# EAGLE board Visually impaired v6 panel - v1 (EAGLE 6.5.0)
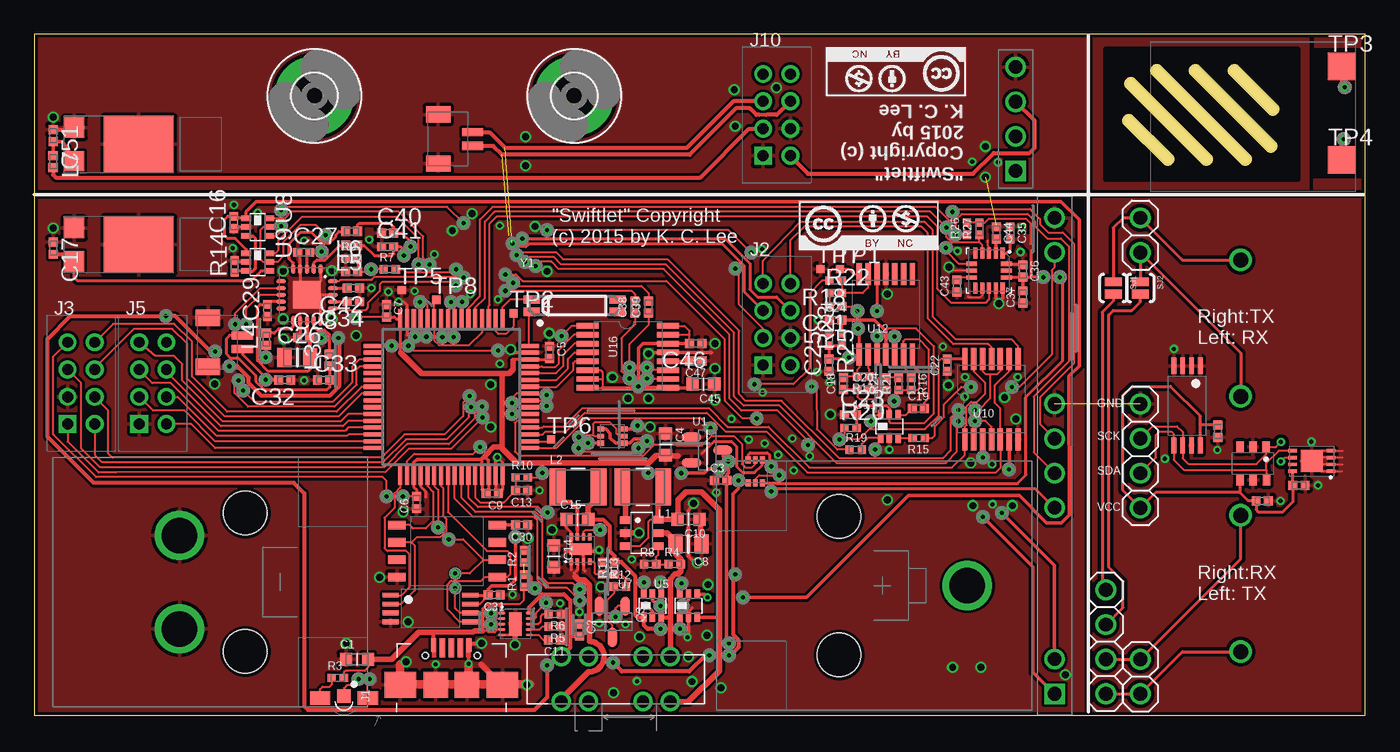
[diagram p4: board, top side]
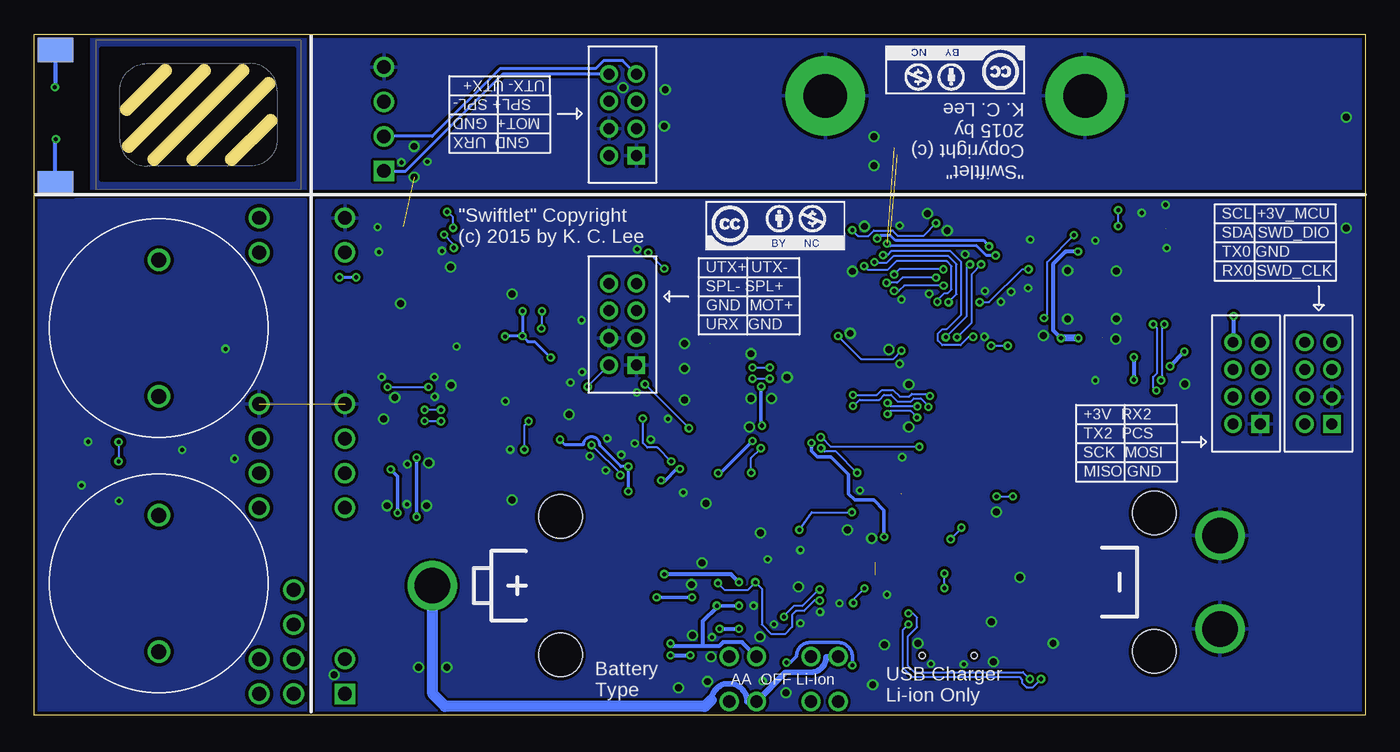
[diagram p5: board, bottom side, seen from below]

Size 97.66 x 50 mm. Coordinates in mm from the lower left corner, seen from the top.
Outline: 0,0 97.66,0 97.66,50 0,50 0,0
Copper layers (1*16): Top 0.035mm / dielectric 1.5mm / Bottom 0.035mm
Design rules "Elecrow 2-layer eagle rule": minimum track width 6mil, minimum drill 12mil, track to track 6mil, track to pad 6mil, pad to pad 6mil, via to via 6mil, smd to smd 0mil, copper to edge 10mil, drill to drill 10mil, minimum pad ring 10mil, minimum via ring 6mil, stop-mask expansion 2mil, vias tented up to drill 100mil, thermal gap 10mil
tRestrict: area 78.6,39.4 to 92.7,48.9; 17 lines
bRestrict: area 78.6,39.4 to 92.7,48.9

## Footprints (pad centres in the part's own frame; a part is rotated, then mirrored left to right if it is on the bottom)
ULTRASONIC_ASM = drill 1: GND 0,3.81; RX+ 0,14.922; RX- 0,17.462; SCK 0,-1.27; SDA 0,1.27; TX- 0,-14.922; VCC 0,-3.81 | drill 1 square: TX+ 0,-17.462
ULTRASONIC-SENSOR-ONLY = drill 1: RX+ 0,2.54; TX+ 0,7.62; TX- 0,5.08 | drill 1 square: RX- 0,0
CAPC1608X92N = smd 0.9 x 0.95: 1 -0.8,0; 2 0.8,0
CAPC1005X60N = smd 0.65 x 0.65: 1 -0.45,0; 2 0.45,0
CAP2012X70N = smd 1.05 x 1.4: 1 -0.95,0; 2 0.95,0
LED_1204 = smd 1 x 1.5: 1 -0.25,-1.75; 3 -0.25,1.75 | smd 1 x 1: 2 -0.4,0
3,2-PAD = drill 3.2 pad 5.842: B3,2 0,0
USB-AB-MICRO-SMD_V03_SF = smd 1.4 x 0.4: D+ 2.7,0; D- 2.7,0.65; ID1 2.7,-0.65 | smd 0.975 x 0.4: GND 2.913,-1.3; VBUS1 2.913,1.3 | smd 1.9 x 2.3: S1 0,3.75; S4 0,-3.75 | smd 1.9 x 1.8: S2 0,1.15; S3 0,-1.15 | hole 0.45: 2.15,1.9; 2.15,-1.9
DF11-8DP-2DSA = drill 0.8 square: 1 3,-1 | drill 0.8: 2 3,1; 3 1,-1; 4 1,1; 5 -1,-1; 6 -1,1; 7 -3,-1; 8 -3,1
BM02B-SRSS-TB = smd 0.6 x 1.55: 1 -0.5,1.825; 2 0.5,1.825 | smd 1.2 x 1.8: PAD@1 -1.8,-0.7; PAD@2 1.8,-0.7
1X04R = drill 1.016: 1 -3.81,0; 2 -1.27,0; 3 1.27,0; 4 3.81,0
1X02 = drill 1.016: 1 -1.27,0; 2 1.27,0
INDC3225X135N = smd 1.15 x 2.7: 1 -1.5,0; 2 1.5,0
INDC1005X60N = smd 0.65 x 0.7: 1 -0.45,0; 2 0.45,0
2RB18Z1BS = smd 1.5 x 1.5: 1 3.28,1.233; 2 3.28,-1.233 | smd 5.15 x 4.12: PAD -1.46,0
CB-AA-PC-POS = drill 2.6: 1 -9.398,0 | hole 3.2: 0,-5.08; 0,5.08
CB-AA-PC-NEG = drill 2.6: 1 4.826,3.429; 2 4.826,-3.429 | hole 3.2: 0,5.08; 0,-5.08
SOT563 = smd 0.375 x 0.5: P$1 -0.517,-0.85; P$3 0.517,-0.85; P$4 0.517,0.85; P$6 -0.517,0.85 | smd 0.34 x 0.5: P$2 0,-0.85; P$5 0,0.85
SOT95P280X135-3N = smd 1.4 x 0.65: 1 -1.15,0.95; 2 -1.15,-0.95; 3 1.15,0
RESC1005X40AN = smd 0.6 x 0.6: 1 -0.45,0; 2 0.45,0
SW-JS203011AQN = drill 0.9: 1 -4,-1.65; 2 -2,-1.65; 3 2,-1.65; 4 4,-1.65; 5 -4,1.65; 6 -2,1.65; 7 2,1.65; 8 4,1.65
SJ_2S-NO = smd 0.635 x 1.27: 1 -0.45,0; 2 0.45,0
2403-269-00001 = smd 2.6 x 1.8 bottom: + 6.7,4.89; - 6.7,-4.89
TCT40-16 = drill 1.1: P$1 -5,0; P$2 5,0
TP06SQ = smd 0.6 x 0.6: TP 0,0
TP20SQ = smd 2 x 2: TP 0,0
LQFP64 = smd 1.5 x 0.3: 1 -5.7,3.75; 2 -5.7,3.25; 3 -5.7,2.75; 4 -5.7,2.25; 5 -5.7,1.75; 6 -5.7,1.25; 7 -5.7,0.75; 8 -5.7,0.25; 9 -5.7,-0.25; 10 -5.7,-0.75; 11 -5.7,-1.25; 12 -5.7,-1.75; 13 -5.7,-2.25; 14 -5.7,-2.75; 15 -5.7,-3.25; 16 -5.7,-3.75; 33 5.7,-3.75; 34 5.7,-3.25; 35 5.7,-2.75; 36 5.7,-2.25; 37 5.7,-1.75; 38 5.7,-1.25; 39 5.7,-0.75; 40 5.7,-0.25; 41 5.7,0.25; 42 5.7,0.75; 43 5.7,1.25; 44 5.7,1.75; 45 5.7,2.25; 46 5.7,2.75; 47 5.7,3.25; 48 5.7,3.75 | smd 0.3 x 1.5: 17 -3.75,-5.7; 18 -3.25,-5.7; 19 -2.75,-5.7; 20 -2.25,-5.7; 21 -1.75,-5.7; 22 -1.25,-5.7; 23 -0.75,-5.7; 24 -0.25,-5.7; 25 0.25,-5.7; 26 0.75,-5.7; 27 1.25,-5.7; 28 1.75,-5.7; 29 2.25,-5.7; 30 2.75,-5.7; 31 3.25,-5.7; 32 3.75,-5.7; 49 3.75,5.7; 50 3.25,5.7; 51 2.75,5.7; 52 2.25,5.7; 53 1.75,5.7; 54 1.25,5.7; 55 0.75,5.7; 56 0.25,5.7; 57 -0.25,5.7; 58 -0.75,5.7; 59 -1.25,5.7; 60 -1.75,5.7; 61 -2.25,5.7; 62 -2.75,5.7; 63 -3.25,5.7; 64 -3.75,5.7
TDFN-10 = smd 0.5 x 0.2: 1 -1,0.8; 2 -1,0.4; 3 -1,0; 4 -1,-0.4; 5 -1,-0.8; 6 1,-0.8; 7 1,-0.4; 8 1,0; 9 1,0.4; 10 1,0.8 | smd 0.9 x 1.7: EP 0,0
SOT26 = smd 0.55 x 0.8: 1 -0.95,-1.2; 2 0,-1.2; 3 0.95,-1.2; 4 0.95,1.2; 5 0,1.2; 6 -1,1.2
DCK_R-PDSO-G6 = smd 0.4 x 0.7: 1 -0.65,-0.85; 2 0,-0.85; 3 0.65,-0.85; 4 0.65,0.85; 5 0,0.85; 6 -0.65,0.85
STDFN22-8 = smd 0.25 x 0.5: 1 -0.675,-0.9; 2 -0.225,-0.9; 3 0.225,-0.9; 4 0.675,-0.9; 5 0.675,0.9; 6 0.225,0.9; 7 -0.225,0.9; 8 -0.675,0.9 | smd 1.6 x 0.85: PAD 0,0
TSSOP14 = smd 0.4 x 1.6: 1 -1.95,-2.851; 2 -1.3,-2.851; 3 -0.65,-2.851; 4 0,-2.851; 5 0.65,-2.851; 6 1.3,-2.851; 7 1.95,-2.851; 8 1.95,3.049; 9 1.3,3.049; 10 0.65,3.049; 11 0,3.049; 12 -0.65,3.049; 13 -1.3,3.049; 14 -1.95,3.049
S0C008 = smd 0.635 x 1.27: 1 -1.905,-3.683; 2 -0.635,-3.683; 3 0.635,-3.683; 4 1.905,-3.683; 5 1.905,3.683; 6 0.635,3.683; 7 -0.635,3.683; 8 -1.905,3.683
TSSOP8 = smd 0.35 x 1.2: 1 -0.975,-2.925; 2 -0.325,-2.925; 3 0.325,-2.925; 4 0.975,-2.925; 5 0.975,2.925; 6 0.325,2.925; 7 -0.325,2.925; 8 -0.975,2.925
QFN4040-20 = smd 0.7 x 0.28: 1 -1.9,1; 2 -1.9,0.5; 3 -1.9,0; 4 -1.9,-0.5; 5 -1.9,-1; 11 1.9,-1; 12 1.9,-0.5; 13 1.9,0; 14 1.9,0.5; 15 1.9,1 | smd 0.28 x 0.7: 6 -1,-1.9; 7 -0.5,-1.9; 8 0,-1.9; 9 0.5,-1.9; 10 1,-1.9; 16 1,1.9; 17 0.5,1.9; 18 0,1.9; 19 -0.5,1.9; 20 -1,1.9 | smd 2 x 2: PAD 0,0
TSSOP16 = smd 0.4 x 1.6: 1 -2.275,-2.85; 2 -1.625,-2.85; 3 -0.975,-2.85; 4 -0.325,-2.85; 5 0.325,-2.85; 6 0.975,-2.85; 7 1.625,-2.85; 8 2.275,-2.85; 9 2.275,3.05; 10 1.625,3.05; 11 0.975,3.05; 12 0.325,3.05; 13 -0.325,3.05; 14 -0.975,3.05; 15 -1.625,3.05; 16 -2.275,3.05
QFN16_0P5_3X3 = smd 0.8 x 0.3: 1 -1.275,1; 2 -1.275,0.5; 3 -1.275,0; 4 -1.275,-0.5; 5 -1.275,-1; 9 1.275,-1; 10 1.275,-0.5; 11 1.275,0; 12 1.275,0.5; 13 1.275,1 | smd 0.3 x 0.8: 6 -0.5,-1.275; 7 0,-1.275; 8 0.5,-1.275; 14 0.5,1.275; 15 0,1.275; 16 -0.5,1.275
SOT1069-2 = smd 0.25 x 0.625: 1 -0.75,-1.413; 2 -0.25,-1.413; 3 0.25,-1.413; 4 0.75,-1.413; 5 0.75,1.413; 6 0.25,1.413; 7 -0.25,1.413; 8 -0.75,1.413 | smd 1.6 x 1.6: PAD 0,0
9HT7 = smd 1.2 x 0.6: 1 -3.15,-0.45; 2 3.15,-0.45; 3 3.15,0.45; 4 -3.15,0.45

## Placement (x,y rotation side)
A1  ULTRASONIC_TEMP  [ULTRASONIC_ASM]  74.85,19.05 0 top
A2  ULTRASONIC-ASM-SENSOR-ONLY  [ULTRASONIC-SENSOR-ONLY]  72,39.95 0 top
C1  4.7uF  [CAPC1608X92N]  23.7,4.11 0 top
C2  1uF  [CAPC1005X60N]  40.01,6.27 270 top
C3  0.1uF  [CAPC1005X60N]  50.37,17.25 0 top
C4  1uF  [CAPC1608X92N]  46.33,19.89 270 top
C5  0.1uF  [CAPC1005X60N]  37.82,26.64 270 top
C6  0.1uF  [CAPC1005X60N]  28.07,15.62 90 top
C7  0.1uF  [CAPC1005X60N]  25.86,29.69 270 top
C8  10uF  [CAP2012X70N]  48.01,12.6 180 top
C9  0.1uF  [CAPC1005X60N]  33.6,16.28 180 top
C10  4.7uF  [CAPC1608X92N]  48.01,14.4 180 top
C11  0.1uF  [CAPC1005X60N]  38.18,5.56 180 top
C12  1nF  [CAPC1005X60N]  23.29,32.56 0 top
C13  1nF  [CAPC1005X60N]  35.76,16.51 180 top
C14  4.7uF  [CAPC1608X92N]  38.13,11.68 270 top
C15  4.7uF  [CAPC1608X92N]  39.85,14.38 0 top
C16  0.1uF  [CAPC1005X60N]  14.66,36.17 90 top
C17  10nF  [CAPC1005X60N]  1.4,34.29 270 top
C18  1nF  [CAPC1005X60N]  59.36,24.36 90 top
C19  1nF  [CAPC1005X60N]  64.87,22.53 0 top
C20  1nF  [CAPC1005X60N]  60.83,23.9 0 top
C21  10nF  [CAPC1005X60N]  58.8,30.02 180 top
C22  1uF  [CAPC1005X60N]  66.98,25.7 90 top
C23  1uF  [CAPC1005X60N]  59.89,22.07 0 top
C24  0.1uF  [CAPC1005X60N]  58.8,29.01 0 top
C25  10nF  [CAPC1005X60N]  58.32,25.7 90 top
C26  10uF  [CAP2012X70N]  19.3,26.26 0 top
C27  1uF  [CAPC1005X60N]  19.79,33.99 0 top
C28  1uF  [CAPC1005X60N]  19.76,27.74 0 top
C29  1uF  [CAPC1005X60N]  17.12,29.72 90 top
C30  1uF  [CAPC1005X60N]  35.76,13.97 180 top
C31  0.1uF  [CAPC1005X60N]  33.76,8.84 180 top
C32  220pF  [CAPC1005X60N]  18.39,24.61 180 top
C33  220pF  [CAPC1005X60N]  21.23,24.61 0 top
C34  0.1uF  [CAPC1005X60N]  23.42,30.35 180 top
C35  0.1uF  [CAPC1005X60N]  71.6,35.41 270 top
C36  0.1uF  [CAPC1005X60N]  72.54,32.61 270 top
C37  1uF  [CAPC1005X60N]  72.54,30.71 90 top
C38  0.1uF  [CAPC1005X60N]  44.07,29.97 90 top
C39  0.1uF  [CAPC1005X60N]  45.09,29.97 90 top
C40  220pF  [CAPC1005X60N]  25.93,35.41 0 top
C41  220pF  [CAPC1005X60N]  25.93,34.39 0 top
C42  0.1uF  [CAPC1005X60N]  23.42,31.37 180 top
C43  0.1uF  [CAPC1005X60N]  67.69,31.52 90 top
C44  0.1uF  [CAPC1005X60N]  70.59,35.41 270 top
C45  4.7uF  [CAPC1608X92N]  49.1,24.31 180 top
C46  0.1uF  [CAPC1005X60N]  48.54,27.3 180 top
C47  1uF  [CAPC1005X60N]  48.54,26.01 180 top
C48  0.1uF  [CAPC1005X60N]  92.79,16.89 180 top
C49  0.1uF  [CAPC1005X60N]  86.84,20.85 90 top
C50  0.1uF  [CAPC1005X60N]  90.09,15.75 180 top
C51  10nF  [CAPC1005X60N]  1.4,42.55 270 top
D1  1204-SIDE-DUAL-AG  [LED_1204]  22.73,1.02 270 top
GRILL1  2403-260-00001-GRILL  [24030269-00001-GRILL]  85.6,44.07 0 bottom
H1  MOUNT-PAD-ROUND3.2  [3,2-PAD]  20.57,45.47 0 top
H2  MOUNT-PAD-ROUND3.2  [3,2-PAD]  39.62,45.47 0 top
J1  [USB-AB-MICRO-SMD_V03_SF]  30.61,2.26 90 top
J2  DF11-8DP-2DSA  [DF11-8DP-2DSA]  54.48,28.7 270 top
J3  DF11-8DP-2DSA  [DF11-8DP-2DSA]  3.45,24.38 270 top
J4  BM02B-SRSS-TB  [BM02B-SRSS-TB]  13.46,27.38 270 top
J5  DF11-8DP-2DSA  [DF11-8DP-2DSA]  8.71,24.38 270 top
J6  [1X04R]  78.61,5.4 270 top
J7  [1X02]  81.15,35.24 90 top
J8  [1X02]  81.15,2.86 90 top
J9  [1X04R]  81.15,19.05 90 top
J10  DF11-8DP-2DSA  [DF11-8DP-2DSA]  54.48,44.07 270 top
J11  BM02B-SRSS-TB  [BM02B-SRSS-TB]  30.35,42.29 270 top
L1  CBC3225T4R7MR  [INDC3225X135N]  44.65,16.76 180 top
L2  CBC3225T4R7MR  [INDC3225X135N]  39.9,16.76 0 top
L3  F600R  [INDC1005X60N]  21.67,26.09 90 top
L4  F600R  [INDC1005X60N]  17.04,27.61 90 top
L5  F600R  [INDC1005X60N]  23.29,34.49 180 top
L6  F600R  [INDC1005X60N]  23.29,35.51 180 top
L7  F600R  [INDC1005X60N]  1.4,40.64 270 top
M1  2RB18Z1BS  [2RB18Z1BS]  6.22,34.54 180 top
M2  2RB18Z1BS  [2RB18Z1BS]  6.22,41.91 180 top
P1  CB-AA-PC-POS  [CB-AA-PC-POS]  59.05,9.53 180 top
P2  CB-AA-PC-NEG  [CB-AA-PC-NEG]  15.49,9.78 180 top
Q1  DMG1023UV  [SOT563]  52.91,17.91 180 top
Q2  DMG1023UV  [SOT563]  42.42,20.5 270 top
Q3  2N7002  [SOT95P280X135-3N]  42.42,6.88 270 top
R1  10K  [RESC1005X40AN]  35.94,9.88 90 top
R2  10K  [RESC1005X40AN]  35.94,11.68 90 top
R3  1K  [RESC1005X40AN]  22.28,2.77 0 top
R4  976K  [RESC1005X40AN]  46.99,11.1 0 top
R5  3.16K  [RESC1005X40AN]  38.2,6.53 180 top
R6  6.65K  [RESC1005X40AN]  38.2,7.44 180 top
R7  1M  [RESC1005X40AN]  26.09,32.74 0 top
R8  562K  [RESC1005X40AN]  45.19,11.1 0 top
R9  562K  [RESC1005X40AN]  23.29,33.53 0 top
R10  220K  [RESC1005X40AN]  35.76,17.48 0 top
R11  1M  [RESC1005X40AN]  42.6,10.82 90 top
R12  402K  [RESC1005X40AN]  42.98,9.45 0 top
R13  665K  [RESC1005X40AN]  41.68,10.82 270 top
R14  0R  [RESC1005X40AN]  14.71,32.94 90 top
R15  10K  [RESC1005X40AN]  64.9,20.37 180 top
R16  220K  [RESC1005X40AN]  64.34,24.33 270 top
R17  22K  [RESC1005X40AN]  60.83,24.87 180 top
R18  22K  [RESC1005X40AN]  58.8,31.9 180 top
R19  10K  [RESC1005X40AN]  60.27,19.51 0 top
R20  22R  [RESC1005X40AN]  59.89,21.11 0 top
R21  1K5  [RESC1005X40AN]  63.42,24.33 90 top
R22  3.16K  [RESC1005X40AN]  58.8,30.99 0 top
R23  10K  [RESC1005X40AN]  59.26,27.58 90 top
R24  1K  [RESC1005X40AN]  62.51,24.33 90 top
R25  10K  [RESC1005X40AN]  58.32,27.58 270 top
R26  10K  [RESC1005X40AN]  68.43,35.71 90 top
R27  10K  [RESC1005X40AN]  69.34,35.71 90 top
S1  CL-SB-23C-11  [SW-JS203011AQN]  42.67,2.67 0 top
SJ1  [SJ_2S-NO]  79.17,31.37 270 top
SJ2  [SJ_2S-NO]  81.15,31.37 270 top
SPK1  2403-260-00001TOP  [2403-269-00001]  89.41,43.94 0 top
T1  TCT40-16T  [TCT40-16]  88.52,28.42 90 bottom
T2  TCT40-16T  [TCT40-16]  88.52,9.68 90 bottom
TP1  TPTP06SQ  [TP06SQ]  59.11,32.77 0 top
TP2  TPTP06SQ  [TP06SQ]  35.18,29.51 0 top
TP3  TPSTP20SQ  [TP20SQ]  95.91,47.62 0 top
TP4  TPSTP20SQ  [TP20SQ]  95.91,40.77 0 top
TP5  TPTP06SQ  [TP06SQ]  26.97,31.22 0 top
TP6  TPTP06SQ  [TP06SQ]  37.92,20.24 0 top
TP7  TPTP06SQ  [TP06SQ]  57.68,32.77 0 top
TP8  TPTP06SQ  [TP06SQ]  29.51,30.51 0 top
U1  MCP1700T-3002E/TT  [SOT95P280X135-3N]  49.38,19.48 0 top
U2  MKL16Z256VLH4  [LQFP64]  30.61,23.37 90 top
U3  AAT3693  [TDFN-10]  35.31,6.71 0 top
U4  MCP1640T-I/CHY  [SOT26]  44.58,13.39 270 top
U5  NLAS4157  [DCK_R-PDSO-G6]  48.01,8.05 0 top
U6  AAT2120  [STDFN22-8]  40.08,12.19 0 top
U7  NLAS4157  [DCK_R-PDSO-G6]  45.36,8.05 0 top
U8  NLAS4157  [DCK_R-PDSO-G6]  16.41,35.84 270 top
U9  NLAS4157  [DCK_R-PDSO-G6]  16.41,33.27 270 top
U10  74LVC08A  [TSSOP14]  70.23,23.11 0 top
U11  TC7SB3157CFU  [DCK_R-PDSO-G6]  62.74,21.21 0 top
U12  LMV324IPWR  [TSSOP14]  62.48,29.34 0 top
U13  S25FL127SABMFI101  [S0C008]  30.3,12.06 270 top
U14  23LC512-I/ST  [TSSOP8]  29.08,7.85 270 top
U15  PAM8404KG  [QFN4040-20]  20.02,30.86 270 top
U16  AK4386ET  [TSSOP16]  43.46,26.31 270 top
U17  FXOS8700CQR1  [QFN16_0P5_3X3]  70.05,32.64 270 top
U18  SE97BTP  [SOT1069-2]  93.73,18.67 90 top
U19  AT24C02  [TSSOP8]  84.58,22.73 180 top
U20  TMP101  [SOT26]  89.41,18.49 180 top
U$1  CC100%  [CC-100]  56.13,34.16 0 top
U$2  CC100%  [CC-100]  48.39,34.16 0 bottom
U$3  CC100%  [CC-100]  48.39,34.16 0 bottom
U$4  CC100%  [CC-100]  68.33,49.02 180 top
U$6  CC100%  [CC-100]  24.99,49.15 180 bottom
Y1  9HT7-32.768KDZF-T  [9HT7]  39.65,30.07 0 top

## Tracks (layer width: path | path; a pad name or v marks a point on that pad's centre or on a via)
1V5/3V  (via drill 0.3)
  Top 0.305: C15.2 41.73,14.38 42.22,13.89 42.22,12.09 42.6,11.71 R11.2 43.06,11.27 44.09,10.24 44.09,7.39 44.27,7.21 44.7,7.21 U7.1 44.71,6.64 45.01,6.35 v45.95,6.35 | U5.1 47.36,6.49 v47.37,6.35
  Top 0.406: L2.2 41.4,16 40.65,15.25 C15.2
  Bottom 0.305: v47.37,6.35 v45.95,6.35
3.3V/!1.5V  (via drill 0.3)
  Top 0.152: v40.03,9.25 39.55,9.68 37.72,9.68 37.29,10.11 37.29,14.45 36.8,14.94 32.38,14.94 31.36,15.96 U2.10 | Q3.1 43.35,8.05 42.82,8.05 42.65,7.87 v42.65,7.24
  Bottom 0.152: v40.03,9.25 40.08,9.25 41.3,8.03 41.94,8.03 42.65,7.32 v42.65,7.24
3V3_BOOST
  Top 0.305: U7.3 46.66,7.2 46.67,7.19
  Top 0.406: S1.8 46.67,7.19 46.67,10.03 47.03,10.39 47.24,10.39 47.45,10.59 R4.2 | U4.5 46.45,13.39 47.02,12.83 47.11,12.74 C8.2 47.11,12.51 47.09,11.81 47.45,11.46 R4.2 | R4.2
3V_CORE  (via drill 0.3)
  Top 0.152: 73.08,34.59 73.08,36.12 72.75,36.45 70.03,36.45 69.74,36.16 R27.2 R26.2
  Top 0.203: Q1.P$6 54.44,17.06 54.48,17.02 72.14,17.02 72.77,17.65 72.77,23.37 75.46,26.06 75.46,31.95 v75.26,32.16 | C36.2 72.52,32.14 U17.14 | C36.2 | U17.1 71.35,33.91 71.6,34.16 C35.2 | C36.2 73.06,32.16 73.15,32.16 | 73.15,32.16 73.15,34.11 | v74.04,32.16 73.15,32.16
  Top 0.254: C36.2 C37.2
  Bottom 0.203: v75.26,32.16 v74.04,32.16
  pour Top (isolate 0.203): 71.45,35.26 73.18,35.26 73.18,34.11 73.1,34.11 72.34,34.87 71.58,34.87 71.45,35
3V_MCU  (via drill 0.3)
  Top 0.152: 32.85,18.9 32.86,18.89 | C6.2 v27.06,16.07 v27.05,16.08 | v23.57,29.16 23.63,29.24 C7.2 | v21.39,35.26 20.68,35.97 19.53,35.97 18.29,34.72 18.29,33.71 17.86,33.27 U9.5 16.79,33.27 16.61,33.45 16.61,35.64 16.82,35.84 U8.5 | v25.86,16.08 25.86,17.22 25.58,17.5 4.55,17.5 1.42,20.62 1.42,26.35 J3.7
  Top 0.203: C5.2 37.62,26.12 U2.30 35.23,26.11 35.13,26.04 | 49,19.23 49.89,20.12 51.16,20.12 51.54,19.74 51.54,18.26 51.97,17.83 52.86,17.83 53.43,18.4 Q1.P$1 | 33.06,18.99 33.36,18.71 U2.14 33.36,16.23 C9.2 32.86,16.58 U2.13 32.86,18.89 32.89,18.92 | U2.3 27.86,16.75 28.07,16.54 C6.2 | C7.2 26.43,29.24 26.59,29.08 26.84,29.08 U2.48 26.86,26.66 26.9,26.62
  Top 0.254: U2.3 27.86,18.56 28.09,18.8 32.77,18.8 32.86,18.89
  Top 0.305: 48.17,18.47 U1.2
  Top 0.406: 34.34,19.61 35.41,18.54 45.06,18.54 45.61,19.09 C4.2 46.37,19.05 47.24,19.05 | 48.21,18.52 U1.2 | 26.9,26.62 28.42,25.09 34.34,25.09 | 34.34,25.09 34.85,25.09 35.13,25.38 35.13,26.04 | 34.34,25.09 34.34,19.61 | 33.06,18.99 33.07,19.05 33.71,19.68 34.27,19.68 34.34,19.61
  Bottom 0.152: v27.05,16.08 v25.86,16.08 | v23.57,29.16 23.34,29.39 23.34,33.27 v21.39,35.26
  pour Top (isolate 0.203): 45.72,19.53 49.4,19.51 49.4,18.26 45.72,18.29
!MEMS_EN
  Top 0.152: Q1.P$2 52.91,18.44 52.68,18.21 52.15,18.21 51.92,18.44 51.92,19.94 51.36,20.5 49.68,20.5 49,19.81 47.14,19.81 47.07,19.89 45.52,19.89 44.65,19.02 35.61,19.02 35.28,19.36 35.28,21.46 35.44,21.62 U2.21
!PERIP_EN  (via drill 0.3)
  Top 0.152: Q2.P$5 42.9,20.5 42.72,20.68 42.72,21.03 42.27,21.49 41.1,21.49 41,21.39 41,20.6 | 41,20.6 41.1,20.5 Q2.P$2 | U2.2 27.36,18.67 27.89,19.2 32.21,19.2 v32.72,19.71 | v39.95,20.42 40.13,20.6 41,20.6
  Bottom 0.152: v32.72,19.71 39.19,19.71 39.9,20.42 v39.95,20.42
!RESET
  Top 0.152: U2.34 33.86,28.2 34.04,28.02 34.65,28.02 35.18,28.55 TP2.TP
!SONAR_EN  (via drill 0.3)
  Top 0.152: Q1.P$5 52.91,17.35 53.19,17.63 v54.66,17.63 | v56.77,19.84 56.77,20.14 54.53,22.38 51.89,22.38 51,23.27 51,27.94 46.18,32.77 38.48,32.77 37.95,33.3 37.11,33.3 v36.78,32.97 | U2.39 31.36,30.32 v31.39,30.35
  Bottom 0.152: v54.66,17.63 54.66,17.75 56.62,19.68 v56.77,19.84 | v36.78,32.97 36.5,32.69 35.05,32.69 34.42,33.33 30.71,33.33 30.35,32.97 30.35,31.27 30.66,30.96 30.91,30.96 31.39,30.48 v31.39,30.35
+1.5V  (via drill 0.3)
  Top 0.203: U9.1 15.56,34.2 14.76,35 14.2,35 13.97,35.23 13.97,36.4 14.19,36.62 C16.2 14.79,36.49 U8.1 15.56,36.97 15.58,37
  Top 0.254: U5.4 49.16,8.9 v49.4,8.66 | v51.99,8.66 56.64,8.66 64.14,16.13 72.26,16.13 74.27,14.12 75.36,14.12 75.95,14.71 75.92,24.89 76.68,25.65 76.68,36.37 75.34,37.72 16.31,37.72 15.58,37
  Bottom 0.254: v49.4,8.66 v51.99,8.66
+3.0V  (via drill 0.3)
  Top 0.203: U15.3 20.02,33.83 C27.2 | U15.9 17.27,30.36 17.27,30.3 C29.2 16.58,30.17 16.38,29.97 16.38,26.04 17.17,25.25 20.09,25.25 20.25,25.41 C26.2 | U15.13 20.02,27.93 C28.2
  Top 0.254: v51.44,10.36 51.26,10.52 51.26,16.26 51.66,16.66 v51.66,17.25 51.85,17.06 Q1.P$4 | Q2.P$1 41.95,21.02 42.27,20.7 42.27,20.37 42.66,19.98 Q2.P$4 43.7,19.98 44.02,20.3 44.81,20.3 v44.96,20.14 | v47.47,17.78 49.17,17.78 49.48,18.09 v50.29,18.09
  Top 0.305: U7.4 46.01,9.72 v45.95,9.78 | v51.44,10.36 51.28,10.19 51.28,5.94 51.66,5.56 51.66,5 51.08,4.42 v50.98,4.42 | v49.53,4.42 49.25,4.42 48.06,3.23 43.13,3.23 v42.47,3.89 | v37.64,3.68 37.64,1.35 36.7,0.41 20.09,0.41 19.81,0.69 19.81,16.31 19.05,17.07 4.37,17.07 0.99,20.45 0.99,27.64 2.67,29.31 v9.68,29.31 10.34,29.31 12.95,26.7 v13.28,26.7 | C28.2 | v21.06,27.69 20.26,27.69 C28.2 | C26.2 20.25,27.69 C28.2 | v22.33,27.69 22.38,27.64 22.38,24.16 21.67,23.44 16.69,23.44 15.75,24.38 15.75,24.79 14.91,25.63 v14.33,25.63 | v21.08,34.04 21.03,33.98 C27.2
  Bottom 0.254: v42.47,3.89 42.19,3.89 41.73,4.34 arc90 40.72,5.36 38.68,5.36 arc90 37.64,4.32 v37.64,3.68 | v44.96,20.14 47.32,17.78 v47.47,17.78 | v50.29,18.09 50.52,18.09 51.38,17.22 51.64,17.22 v51.66,17.25
  Bottom 0.305: v45.95,9.78 46.53,10.36 v51.44,10.36 | v50.98,4.42 v49.53,4.42 | v9.68,29.31 9.68,27.42 J5.8 | v14.33,25.63 v13.28,26.7 | v21.08,34.04 22,34.04 22.91,33.12 22.91,28.27 v22.33,27.69
  Bottom 0.508: v21.06,27.69 v22.33,27.69
+3V_AUDIO  (via drill 0.3)  (1 unrouted)
  Top 0.152: U16.16 47.71,28.59 48.09,28.21 48.09,27.94 | U16.7 41.7,24.69 41.71,24.66 | U16.8 41.71,24.04 41.71,24.66 | U16.6 41.54,25.34 41.71,25.17 41.71,24.66 | 45.24,27.29 45.59,27.29 | U16.15 48.09,27.94 | 44.31,24.04 v44.32,24.13 | C46.2 48.09,27.94
  Top 0.254: C46.2 U16.14 45.59,27.29 44.66,27.29 44.32,26.95 v44.32,24.13 | U16.9 48.06,24.04 C45.2 | v44.27,21.26 44.03,21.02 Q2.P$6
  Top 0.305: 41.71,24.04 44.31,24.04 | U16.9 44.34,24.04 v44.32,24.13
  Bottom 0.254: v44.32,24.13 44.32,21.26 v44.27,21.26
+3V_SONAR  (via drill 0.3)
  Top 0.152: C22.2 66.52,26.16 66.37,26.01 66.37,22.02 65.35,21.01 61.27,21.01 60.5,20.24 v59.08,20.24 59.44,20.61 R20.1
  Top 0.203: Q1.P$3 52.39,19.14 52.53,19.28 53.77,19.28 53.95,19.1 53.95,18.39 v54.08,18.26 | v54.08,16.43 54.25,16.61 73.46,16.61 A1.VCC | U10.14 66.99,26.16 C22.2
  Bottom 0.203: v59.08,20.24 58.7,19.86 57.38,19.86 arc90 56.74,20.45 arc90 56.16,19.81 54.61,18.26 v54.08,18.26 54.05,18.24 54.05,16.51 v54.08,16.43
+3V_SONAR_FILTERED
  Top 0.152: U11.5 62.74,21.59 62.87,21.44 65.28,21.44 66.02,22.17 66.02,27.08 64.69,28.4 62.68,28.4 62.48,28.19
  Top 0.203: R20.2 C23.2 60.34,22.57 60.5,22.73 62.53,22.73 62.74,22.53 U11.5 | R23.2 C24.2
  Top 0.254: U12.4 62.48,28.19 61.64,29.03 59.12,29.03 C24.2
+3V_SPI  (via drill 0.3)
  Top 0.152: U14.7 32.71,8.17 33.31,8.77 C31.2
  Top 0.203: U14.8 33.25,8.82 C31.2
  Top 0.254: U13.8 C30.2 v35.31,13.11 35.31,9.96 34.85,9.5 33.55,9.5 33.31,9.25 C31.2 | v40.64,19.99 v40.63,19.98 Q2.P$3
  Top 0.305: 35.32,13.94 C30.2
  Bottom 0.254: v35.31,13.11 35.31,15.04 36.07,15.8 37.47,15.8 37.92,16.26 37.92,17.7 39.19,18.97 40.21,18.97 40.64,19.41 v40.64,19.99
+UB
  Top 0.203: U3.10 36.3,7.52 36.3,7.82
  Top 0.292: 37.27,8.9 38.88,8.9
  Top 0.305: 38.88,8.9 39.32,8.46 39.32,5.87 | 39.32,5.87 39.32,4.96 S1.5 | C2.2 39.34,5.82 39.32,5.87 | 37.27,8.9 36.3,7.92 36.3,7.82
  Bottom 0.305: P1.1 68.43,9.53
  Bottom 0.406: S1.3 | 47.98,1.14 arc90 46.66,2.34 arc90 45.36,1.01 S1.3 | S1.3 42.54,3.17 40.66,3.17 arc-90 39.56,4.28 39.52,4.32 S1.5
  Bottom 0.813: 68.43,9.53 68.43,1.57 67.51,0.66 48.46,0.66 47.98,1.14
BATT_SENSE1  (via drill 0.3)
  Top 0.152: U2.44 28.86,30.15 28.68,30.33 v28.3,30.33 | R9.2 C12.2 24.54,32.56 v24.71,32.74 R7.1
  Bottom 0.152: v28.3,30.33 27.61,30.33 25.17,32.74 v24.71,32.74
BATT_SENSE2
  Top 0.152: U2.12 32.36,16 32.72,15.65 34.47,15.65 35.08,16.26 C13.2 R10.1
BUCK_PWR_EN  (via drill 0.3)
  Top 0.152: U6.6 40.31,13.48 40.44,13.61 v41.53,13.61 | v37.67,14.91 37.34,14.91 36.96,15.29 32.56,15.29 31.88,15.97 U2.11
  Bottom 0.152: v41.53,13.61 40.62,14.91 v37.67,14.91
BYP
  Top 0.254: U17.2 70.55,35 C44.2
CMP0_OUT
  Top 0.152: U2.36 32.86,28.11 31.93,27.18 29.69,27.18 29.36,27.51 U2.43 29.36,30.31 TP8.TP
CRST
  Top 0.152: U17.8 67.77,32.13 67.71,32.07 C43.2
  Top 0.203: U17.8
DAC
  Top 0.152: U2.18 37.82,20.12 TP6.TP
DAC_EN
  Top 0.152: U2.26 38.32,24.12 39.52,25.32 39.52,25.83 39.68,25.99 U16.5
GND  (via drill 0.3, 0.51)  (5 unrouted)
  Top 0.127: U18.4 96,19.42 96.01,19.43 | U18.3 96.01,18.92 | U18.2 95.98,18.42 95.99,18.41 | U18.1 95.95,17.92 95.96,17.91
  Top 0.152: U3.5 34.94,5.91 35.28,6.12 | U17.7 67.23,32.64 67.11,32.51 | U17.3 70.05,34.37 69.98,34.44 69.98,34.87 | U17.10 69.55,30.84 69.39,30.68 68.58,30.68 68.5,30.76 | 21.02,31.86 U15.PAD 21.02,29.86 | U18.4 94.48,19.42 94.13,19.07 | 94.13,19.07 U18.PAD | U18.3 94.29,18.92 94.13,19.07 | U18.2 93.98,18.42 U18.PAD | U18.1 94.48,17.92 U18.PAD
  Top 0.203: 40.31,11.97 U6.3 40.31,10.7 40.41,10.59 | 39.5,12.19 39.5,11.98 39.51,12.03 | U6.8 39.41,13.43 39.04,13.79 39.04,14.4 | U2.4 28.36,16.8 28.73,16.43 28.73,16.03 | U17.16 72.46,33.14 72.49,33.17 | U15.12 19.52,27.94 C28.1 | 19.51,30.61 19.52,30.6 19.75,30.6 U15.PAD | U15.1 21.02,31.86 | U15.PAD 19.52,31.36 U15.4 19.52,33.85 19.38,33.98 | U15.18 U15.PAD | v26.75,30.35 27.13,30.35 27.36,30.13 U2.47 27.36,27.89 | U15.15 21.02,30.8 20.98,30.84 | v18.26,29.11 18.26,29.08 | U9.2 14.83,33.27 R14.2 | U8.2 14.76,35.84 14.66,35.74 | U5.2 48.01,7.62 48.28,7.9 | U2.15 33.86,16.43 C9.1 34.36,16.55 U2.16 34.36,18.58 v33.98,18.95 33.86,18.77 U2.15
  Top 0.254: U17.13 71.05,30.67 70.79,30.4 70.55,30.64 U17.12 | U6.8 39.41,12.28 39.5,12.19 U6.PAD | 40.31,11.97 U6.PAD | 38.95,12.03 39.51,12.03 | 40.07,12.2 U6.PAD | U6.PAD 40.32,12.03 41.23,12.03 | 48.01,7.19 U5.2 48.01,5.84 v47.93,5.74 | v48.39,15.54 48.06,15.09 48.01,15.01 48.01,11.66 48.44,11.23 | U7.2 45.36,7.64 44.93,8.08 | 45.14,26.64 U16.13 49.68,26.64 | J1.GND 31.91,4.93 | 31.88,3.84 v31.88,3.79 31.88,5.16 | U2.31 35.23,26.62 34.98,26.82
  Top 0.305: 31.86,3.77 31.75,3.66 31.75,2.43 J1.S3 | J1.GND 31.88,5.17 | 31.91,4.93 31.93,4.95 31.93,5.23 31.9,5.31 v32.84,5.31 | C51.1 2.94,42.99 2.95,43
  Top 0.406: U3.EP 35.28,6.12 35.28,5.26 | 26.86,3.74 26.87,3.76 | 34.34,2.3 J1.S4 | U4.2 v44.37,13.39 44.37,13.41 | 33.68,2.87 32.79,3.76 | C10.1 48.9,14.31 48.9,12.65
  Top 0.61: J1.S1 26.86,3.74 | 31.86,2.31 31.86,3.77 | 36.37,2.27 26.03,2.27
  other vias: 29.46,3.76 41.45,12.14 48.67,11.2 50.39,2.03 35.28,5.18 44.88,8.05 49.38,5.87 44.42,5.77 40.01,7.59 38.58,8.23 41.45,6.76 43.38,6.68 41.58,9.42 48.01,4.29 43.84,11.46 49.43,9.6 42.49,1.65 45.06,26.54 33.5,24.28 33.5,21.18 36.14,2.26 49.94,27.3 48.26,2.49 37.08,16.51 52.43,20.24 36.22,13 35.1,8.86 27.43,6.88 22.91,5.28 25.35,10.13 27.3,3.94 72.03,21.74 70.31,15.49 68.86,15.39 68.71,18.54 70.28,18.44 71.75,15.39 72.47,35.84 69.47,3.53 67.39,3.53 67.74,34.09 72.36,34.01 67.08,24.23 55.73,17.98 67.11,32.89 62.59,15.82 34.95,26.85 21.84,29.08 21.84,32.64 18.26,32.61 18.31,27.64 24.74,31.37 49.94,25.45 32,30.94 37.8,28.04 42.42,24.82 34.16,25.81 27.94,27.79 19.81,34.85 62.59,30.91 62.74,19.51 58.42,22.07 68.28,23.39 72.16,24.84 68.3,24.84 27.08,14.94 50.04,16.36 57.51,29.01 55.63,20.32 58.32,24.43 53.59,19.96 54.58,19.13 56.9,19.02 51.16,21.77 34.04,30.53 29.36,33.83 30.68,35.59 70.79,30.23 71.2,23.34 53.42,34.21 24.59,34.92 34.16,35.94 49.94,23.14 32.13,36.83 19.81,24.59 14.58,34.29 16.41,36.88 14.66,37.47 53.44,23.7 75.64,2.97 44.22,2.51 36.75,35.89 37.64,32.59 63.09,23.06 13.26,24.31 23.62,27.89 25.98,31.09 27.91,31.14 45.19,21.16 38,13.61 45.09,23.27 43.56,23.27 93.7,20.09 83.62,26.9 86.79,19.48 82.96,18.85 91.44,15.75 94.18,16.89 1.4,43.92 1.4,35.76 51.44,43.26 36.04,40.34 36.04,42.47 51.36,45.92 54.46,46.05 69.77,41.76 70.71,40.59 69.77,39.5 68.81,40.64 57.45,25.2 66.67,27.08
  pour Top (isolate 0.203, rank 3): 0,37.85 76.96,37.85 76.96,0 0,0
  pour Bottom (isolate 0.203, rank 3): 0,0 76.96,0 76.96,37.85 0,37.85
  pour Top (isolate 0.203, no thermals): 18.77,32.11 21.26,32.11 21.26,29.62 18.77,29.62
  pour Top (isolate 0.254): 77.72,37.85 97.66,37.85 97.66,0 77.72,0
  pour Bottom (isolate 0.254): 97.66,37.85 77.72,37.85 77.72,0 97.66,0
  pour Top (isolate 0.203, rank 3): 0,50.04 77.22,50.04 77.22,38.61 0,38.61
  pour Bottom (isolate 0.203, rank 3): 0,38.61 77.22,38.61 77.22,50.04 0,50.04
  pour Bottom (isolate 0.203, rank 3): 77.72,38.61 93.47,38.61 93.47,50.04 77.72,50.04
  pour Top (isolate 0.203, rank 3): 93.47,38.61 77.72,38.61 77.72,50.04 93.47,50.04
  pour Top (isolate 0.203, rank 3): 97.66,49.02 93.98,49.02 93.98,50.04 97.66,50.04
  pour Top (isolate 0.203, rank 3): 97.54,38.61 93.93,38.61 93.93,39.37 97.54,39.37
I2C0_INT
  Top 0.152: U17.11 70.05,30.56 69.77,30.28 67.28,30.28 66.27,31.29 66.27,35.87 65.53,36.6 33.93,36.6 33.43,36.09 33.43,30.12 33.36,30.03 U2.35
I2C0_SCL  (via drill 0.3)
  Top 0.152: U17.4 69.55,34.51 69.37,34.7 | 69.37,34.7 67.33,34.7 66.93,35.1 v66.93,35.79 66.4,36.3 65.73,36.96 33.78,36.96 33.07,36.25 33.07,30.63 32.36,29.92 U2.37 | 69.37,34.7 69.34,34.72 R27.1 | v67.36,36.96 67.56,37.16 73.05,37.16 73.79,36.42 73.79,36.04 74.4,35.43 75.46,35.43 76.28,34.62 76.28,25.83 73.79,23.34 73.79,21.39 A1.SDA
  Bottom 0.152: v66.93,35.79 66.93,36.55 v67.36,36.96
I2C0_SDA  (via drill 0.3)
  Top 0.152: R26.1 68.41,35.28 v67.59,35.28 67.59,36.35 | 67.59,36.35 68.05,36.8 72.9,36.8 73.43,36.27 73.43,35.92 74.35,35 75.34,35 75.92,34.42 75.92,25.98 73.33,23.39 73.33,19.3 A1.SCK | 67.59,36.35 67.11,36.35 66.14,37.31 33.63,37.31 32.72,36.4 32.72,30.76 31.86,29.9 U2.38 | U17.6 67.85,33.14 66.88,34.11 v66.88,34.31
  Bottom 0.152: v66.88,34.31 66.88,34.57 v67.59,35.28
I2C1_SCL
  Top 0.152: U2.55 24.02,24.12 22.2,22.3 14.15,22.3 11.58,24.87 11.58,27.43 10.29,28.73 5.79,28.73 J3.8
I2C1_SDA
  Top 0.152: U2.56 24.02,23.62 22.35,21.95 13.99,21.95 11.23,24.71 11.23,27.28 10.13,28.37 7.32,28.37 4.45,25.5 J3.6
I2S0_MCLK  (via drill 0.3)
  Top 0.152: U16.1 39.44,28.59 v38.68,27.84 | U2.49 v26.24,27.13 | v27.46,27.13 27.81,26.77 v34.04,26.77
  Bottom 0.152: v34.04,26.77 34.67,26.14 36.98,26.14 v38.68,27.84 | v26.24,27.13 v27.46,27.13
I2S0_TX_BCLK
  Top 0.152: U2.27 38.31,24.62 39.17,25.48 39.17,26.16 39.65,26.64 40.99,26.64 U16.4
I2S0_TX_FS
  Top 0.152: U2.29 37.25,25.62 37.29,25.58 38.25,25.58 38.46,25.78 38.46,26.77 39.62,27.94 U16.2
I2S0_TXD0
  Top 0.152: 40.59,27.3 U16.3 39.63,27.29 38.81,26.47 38.81,25.63 38.3,25.12 U2.28
LEFT_EN  (via drill 0.3)
  Top 0.152: 61.75,18.9 59.03,18.9 54.84,23.09 52.2,23.09 51.71,23.57 51.71,28.25 46.48,33.48 38.79,33.48 38.28,33.98 35.59,33.98 v35.38,33.78 | 61.75,18.9 66.7,18.9 67.23,19.43 67.23,21.84 v67.82,22.43 | U10.10 70.88,25.26 70.66,25.04 70.13,25.04 | 70.13,25.04 70.13,23.27 69.29,22.43 v69.01,22.43 | U10.12 69.58,25.26 69.8,25.04 70.13,25.04 | v61.7,19.51 61.7,18.95 61.75,18.9 | v61.39,21.59 61.39,21.87 61.58,22.06 U11.6 | U2.45 28.36,28.21 v28.78,27.79
  Bottom 0.152: v67.82,22.43 v69.01,22.43 | v61.7,19.51 61.7,21.29 v61.39,21.59 | v28.78,27.79 29.08,27.79 29.69,27.18 31.04,27.18 31.37,27.51 31.37,28.02 31.04,28.35 30.71,28.35 29.64,29.41 29.64,33.27 30.43,34.06 34.8,34.06 35.08,33.78 v35.38,33.78
LMOT+  (via drill 0.3)
  Top 0.152: v52.6,33.96 50.93,35.61 v37.64,35.61 | v31.5,36.12 30.3,37.31 18.36,37.31 v18.14,37.08 | v18.14,35.92 18.14,35.56 17.77,35.19 U8.4 | v51.44,32.79 51.69,32.54 51.69,30.18 53.48,28.38 J2.3
  Bottom 0.152: v18.14,35.92 v18.14,37.08 | v51.44,32.79 v52.6,33.96 | v37.64,35.61 37.21,35.18 36.47,35.18 36.07,35.59 34.7,35.59 34.34,35.23 32.38,35.23 v31.5,36.12
LMOT+1
  Top 0.254: M2.1 2.41,41.21 2.41,41.73 2.05,42.09 C51.2 L7.1
MOT_LEFT  (via drill 0.3)
  Top 0.152: U2.41 30.36,28.19 v30.79,27.76 | v29.01,33.1 29.01,33.12 28.55,33.58 28.55,35.15 26.75,36.96 18.87,36.96 18.41,36.49 U8.6
  Bottom 0.152: v30.79,27.76 29.23,29.31 29.23,32.87 v29.01,33.1
MOT_RIGHT  (via drill 0.3)
  Top 0.152: U2.42 29.86,27.88 v29.95,27.76 | v28.19,33.1 28.19,35 26.59,36.6 19.66,36.6 17.93,34.87 17.93,34.14 17.72,33.92 U9.6
  Bottom 0.152: v29.95,27.76 28.88,28.83 28.88,32.38 28.19,33.07 v28.19,33.1
N$1  (via drill 0.3)
  Top 0.152: A1.RX+ 74.85,32.87 74.65,32.66 74.65,26.49 72.26,24.11 v71.73,24.11 | v68.73,24.11 68.02,24.11 66.75,22.84 66.75,21.89 66.06,21.21 66.06,20.55 65.89,20.37 R15.1
  Bottom 0.152: v71.73,24.11 v68.73,24.11
N$2
  Top 0.203: J6.2 78.65,6.67 79.88,7.9 79.88,9.83 78.84,10.87 78.84,29.39 79.17,29.72 80.52,29.72 81.15,30.35 SJ2.2
N$3
  Top 0.203: U8.3 16.07,35.19 16.23,35.03 16.23,32.79 16.06,32.62 U9.3 14.84,32.62 R14.1
N$4
  Top 0.406: U4.1 43.38,16.56 L1.2
N$5
  Top 0.152: U3.6 36.99,5.91 37.34,5.56 C11.2
N$6
  Top 0.152: U3.7 37.09,6.31 37.31,6.53 R5.2
N$7
  Top 0.152: U3.8 36.98,6.71 37.19,6.91 37.19,7.29 37.34,7.44 R6.2
N$8
  Top 0.152: D1.1 20.98,1.93 21.16,2.11 21.67,2.11 21.83,2.27 R3.1
N$9  (via drill 0.3)
  Top 0.152: U3.2 34.02,7.11 33.63,7.49 v33.53,7.49 | D1.3 24.48,2.54 v24.61,2.67
  Bottom 0.152: v24.61,2.67 25.12,3.17 33.1,3.17 33.55,3.63 33.55,5.82 32.89,6.48 32.89,7.19 33.2,7.49 v33.53,7.49
N$10  (via drill 0.3)
  Top 0.152: D1.2 22.73,2.01 22.94,2.21 23.34,2.21 v23.8,2.67 | U3.3 33.58,6.71 v33.53,6.68
  Bottom 0.152: v33.53,6.68 33.91,6.3 33.91,3.48 33.25,2.82 25.4,2.82 25.2,2.62 25.2,2.41 24.87,2.08 24.38,2.08 v23.8,2.67
N$11
  Top 0.152: U3.1 34.28,7.48 34.29,7.85 | 34.29,8.15 35.61,8.15 35.94,8.48 R1.1 | C1.2 24.5,3.52 24.26,3.28 22.84,3.28 22.73,3.17 R3.2 | U3.4 33.99,6.31 33.78,6.1 33.35,6.1 33.17,6.22 32.92,6.22
  Top 0.203: 33.3,8.15 33.25,8.15 32.92,7.82 32.92,6.22 32.89,6.22
  Top 0.305: 34.29,7.85 34.29,8.15 33.3,8.15 | J1.VBUS1 29.31,6.07 29.34,6.1
  Top 0.406: C1.2 26.24,4.12 28.22,6.1 29.34,6.1 32.21,6.12 32.31,6.22 32.89,6.22
N$12  (via drill 0.3)  (1 unrouted)
  Top 0.152: U3.9 36.72,7.11 36.83,7.21 36.83,7.52 v37.57,8.26 | v36.75,9.32 36.52,9.55 36.52,10.19 36.38,10.33 R1.2
  Bottom 0.152: v37.57,8.26 37.57,8.51 v36.75,9.32
N$13
  Top 0.203: J7.2 84.25,33.42 T1.P$2 | 81.14,36.52 J7.2 | J7.2 79.9,36.51 79.17,35.79 SJ1.1
N$14
  Top 0.152: U2.32 36.31,29.56 Y1.1
N$15
  Top 0.152: U2.33 34.36,29.96 34.92,30.52 Y1.4
N$16
  Top 0.152: U19.5 | 90.4,18.03 84.33,18.03 83.61,18.75 U19.5 | J9.2 82.3,18.92 82.3,20.57 82.55,20.83 83.44,20.83 83.61,20.66 U19.5 | 90.4,18.03 90.4,18.52 91.3,19.42 U18.5 | 90.4,18.03 U20.6
N$17
  Top 0.152: R22.1 C21.2
N$18
  Top 0.152: R19.2 60.72,19.93 61.15,20.36 U11.1
N$19
  Top 0.152: R18.1 R22.2 60.78,30.99 61.18,31.39 U12.13
N$20
  Top 0.152: C19.2 65.32,22.95 65.66,23.29 65.66,26.85 64.9,27.61 63.93,27.61 63.78,27.46 U12.6 63.78,25.57 64.11,25.25 64.26,25.25 64.34,25.17 R16.1
N$21
  Top 0.152: R21.1 R16.2 64.8,23.88 64.92,24 64.92,25.3 64.82,25.4 64.67,25.4 64.43,25.63 U12.7
N$22
  Top 0.152: C18.1 C20.1 60.38,23.39 60.53,23.24 61.72,23.24 61.9,23.42 61.9,24.66 62.02,24.78 R24.2 R21.2
N$23
  Top 0.152: U12.2 61.18,25.48 61.28,25.38 R17.1 C20.2
N$24
  Top 0.152: U11.3 64,20.36 R15.2
N$25  (via drill 0.3)
  Top 0.152: J9.3 82.04,21.21 83.84,21.21 84.25,20.8 U19.6 84.26,18.87 84.68,18.44 89.66,18.44 90.36,19.14 U20.1 91.09,19.69 v91.47,20.07 | v91.47,18.64 91.75,18.92 U18.6
  Bottom 0.152: v91.47,20.07 v91.47,18.64
N$26
  Top 0.203: U15.17 22.93,30.36 C34.2
N$27
  Top 0.254: U16.12 48.08,25.99 C47.2
N$28
  Top 0.203: U15.19 22.93,31.36 C42.2
N$29
  Top 0.152: U11.4 63.95,22.06 C19.1
N$30  (via drill 0.3)
  Top 0.152: U16.10 45.01,24.69 v44.96,24.71 | v43.69,24.71 43.64,24.71 43.08,25.27 43.08,27.69 44.07,28.68 C38.1
  Bottom 0.152: v44.96,24.71 v43.69,24.71
N$31  (via drill 0.3)
  Top 0.152: U15.16 22.36,29.86 22.48,29.74 24.31,29.74 24.49,29.92 24.49,30.28 25.35,31.14 25.35,31.62 25.53,31.8 30.68,31.8 v30.94,31.55 | v34.57,31.17 43.81,31.17 44.07,30.91 C38.2
  Bottom 0.152: v30.94,31.55 33.83,31.55 34.21,31.17 v34.57,31.17
N$32
  Top 0.152: U4.4 45.78,11.77 45.64,11.63 R8.2 R4.1
N$33  (via drill 0.3)
  Top 0.152: U16.11 45.15,25.34 v44.96,25.53 | v43.69,25.53 43.69,27.25 45.09,28.65 C39.1
  Bottom 0.152: v44.96,25.53 v43.69,25.53
N$34
  Top 0.203: J8.1 84.25,4.68 T2.P$1 | 81.11,1.63 J8.1 | J6.4 J8.1
N$35  (via drill 0.3)
  Top 0.152: U15.20 22.36,31.86 22.48,31.98 24.77,31.98 24.94,32.16 31.47,32.16 v31.5,32.13 | v35.13,31.75 35.36,31.52 44.55,31.52 45.09,30.99 C39.2
  Bottom 0.152: v31.5,32.13 33.96,32.13 34.34,31.75 v35.13,31.75
N$36
  Top 0.203: 38.71,15.65 38.41,15.95 L2.1 | U6.7 39.86,13.64 39.85,13.64
  Top 0.254: 38.43,16.74 L2.1
  Top 0.305: 39.85,13.64 39.85,15.14 39.32,15.67 38.73,15.67 38.71,15.65
N$37
  Top 0.203: T2.P$2 88.52,11.49 J8.2 J6.3
N$38
  Top 0.203: J6.1 78.36,9.46 78.36,29.59 79.17,30.4 SJ1.2
N$39
  Top 0.152: U6.4 41.01,11.29 41.1,11.2 41.1,10.49 41.22,10.37 R13.2 R11.1 43.07,10.37 43.43,10.02 R12.2
N$40
  Top 0.203: U15.14 20.52,28.53 20.75,28.3 21.31,28.3 21.67,27.94 L3.2
N$41
  Top 0.203: U15.11 19.02,28.54 18.85,28.37 17.93,28.37 17.62,28.06 L4.2
N$42
  Top 0.152: Q3.3 42.42,6.6 42.06,6.96 42.06,8.48 42.53,8.95 R12.1
N$43
  Top 0.203: U15.2 20.52,33.19 20.75,33.43 21.34,33.43 22.4,34.49 L5.2
N$44
  Top 0.203: U15.5 19.02,33.21 18.72,33.5 18.72,34.62 19.56,35.46 20.32,35.46 21.13,34.65 21.64,34.65 22.15,35.15 22.15,35.28 22.38,35.51 L6.2
N$45
  Top 0.203: T1.P$1 88.52,26.61 J7.1 SJ2.1
N$48
  Bottom 0.203: J10.7 53.49,47.07 54.48,48.06 55.88,48.06 56.46,47.47 63.48,47.47 68.45,42.49 A2.RX+
N$49
  Top 0.305: J10.2 55.48,41.04 56.77,39.75 68.89,39.75 70.41,41.27 73.03,41.27 73.41,41.66 73.41,43.63 A2.TX-
N$50
  Top 0.305: L7.2 1.4,39.67 1.6,39.47 48.87,39.47 52.45,43.05 53.47,43.05 J10.3
N$51  (via drill 0.3)
  Top 0.305: TP3.TP 95.91,46.33 v96.14,46.1
  Bottom 0.305: SPK1.+ 96.11,46.13 v96.14,46.1
N$52  (via drill 0.3)
  Top 0.305: TP4.TP 95.91,42.14 v96.06,42.29
  Bottom 0.305: SPK1.- 96.11,42.25 v96.06,42.29
PWR_SRC  (via drill 0.3)
  Top 0.152: v47.5,9.7 47.35,9.55 47.35,8.91 U5.6 | U7.6 44.71,9.74 v44.76,9.78 | v40.03,8.43 40.01,8.43 39.09,9.35 37.54,9.35 36.93,9.96 36.93,14.3 36.65,14.58 32.21,14.58 30.86,15.93 U2.9
  Bottom 0.152: v47.5,9.7 46.99,9.2 45.34,9.2 v44.76,9.78 44.27,9.3 44.27,6.68 43.59,5.97 42.6,5.97 42.06,6.5 42.06,7.37 41.76,7.67 41.17,7.67 40.41,8.43 v40.03,8.43
RIGHT_EN  (via drill 0.3)
  Top 0.152: v67.82,21.59 67.69,21.46 67.69,19.36 66.88,18.54 58.88,18.54 54.69,22.73 52.05,22.73 51.36,23.42 51.36,28.09 46.33,33.12 38.63,33.12 38.1,33.66 36.4,33.66 v36.02,33.27 | U10.2 68.94,21.54 v69.01,21.61 69.8,21.61 70.23,21.18 U10.4 | U2.40 30.86,30.05 v30.58,30.33
  Bottom 0.152: v67.82,21.59 68.96,21.59 v69.01,21.61 | v30.58,30.33 30,30.91 30,33.12 30.58,33.71 34.62,33.71 35.13,33.2 35.89,33.2 v36.02,33.27
RMOT+
  Top 0.203: U9.4 16.65,32.62 15.9,31.88 3.2,31.88 2.94,32.13 M1.1
  Top 0.305: C17.2 2.41,33.84 M1.1
RX2
  Top 0.152: J5.7 8.88,26.39 10.26,26.39 10.87,25.78 10.87,24.56 13.84,21.59 22.5,21.59 23.03,22.12 U2.59
SP_L+  (via drill 0.3)  (1 unrouted)
  Top 0.203: v35.1,34.62 35.33,34.39 36.07,34.39 36.27,34.59 50.49,34.59 52.09,33 52.09,31.1 J2.5 | v27.13,33.76 27,33.88 27,34.29 26.9,34.39 C41.2 26.39,33.88 26.24,33.73 24.97,33.73 24.21,34.49 L5.1
  Top 0.305: J11.1 33.41,42.79 34.54,41.66 47.88,41.66 51.29,45.07 J10.5
  Bottom 0.203: v27.13,33.76 27.81,33.76 28.55,34.47 34.87,34.44 35.08,34.65 v35.1,34.62
SP_L-  (via drill 0.3)  (1 unrouted)
  Top 0.203: v35.81,35 50.67,35 52.5,33.17 52.5,31.27 53.06,30.71 54.48,30.71 J2.6 | v27.61,34.42 27.61,34.77 26.98,35.41 C40.2 26.38,35.85 26.11,36.12 23.85,36.12 23.74,36.01 L6.1
  Top 0.254: 53.72,44.07 53.21,44.07
  Top 0.305: J10.6 54.48,44.07 53.72,44.07 | 53.21,44.07 52.98,44.07 52.5,44.55 51.49,44.55 48.08,41.15 34.31,41.15 33.67,41.79 J11.2
  Bottom 0.203: v27.61,34.42 27.99,34.85 34.47,34.85 34.85,35.23 35.59,35.23 v35.81,35
SP_R+
  Top 0.203: L3.1 21.67,24.64 C33.2 21.68,24.1 21.49,23.9 16.87,23.9 16.26,24.51 16.26,24.94 14.96,26.24 14.4,26.24 14.1,26.54 14.1,27.64 14.34,27.88 J4.1
SP_R-  (via drill 0.3)
  Top 0.203: v16.99,26.29 17.04,26.34 L4.1 | J4.2 15.29,26.49 16.99,24.79 v16.99,24.64
  Top 0.305: C32.2 17.02,24.61 v16.99,24.64
  Bottom 0.305: v16.99,26.29 v16.99,24.64
SPI0_MISO
  Top 0.152: U2.7 29.86,16.85 30,16.71 30,14.66 30.23,14.43 30.23,13.54 29.77,13.08 28.07,13.08 27.69,12.7 | U14.2 26.92,8.17 27.91,9.17 27.91,12.47 27.69,12.7 | 27.69,12.7 U13.2
SPI0_MOSI
  Top 0.152: U14.5 31.23,6.87 30.33,7.77 30.33,9.6 30.61,9.88 32.79,9.88 33.07,10.16 U13.5 34.72,10.16 34.9,10.34 34.9,11.89 34.72,12.06 33.22,12.06 30.36,14.93 U2.8
SPI0_PCS0A
  Top 0.152: U13.1 27.53,13.97 27.79,13.72 28.73,13.72 29.29,14.28 29.29,16.41 28.86,16.84 U2.5
SPI0_PCS0B
  Top 0.152: U14.1 26.96,8.82 27.56,9.42 27.56,11.81 27.3,12.06 25.91,12.06 25.7,12.27 25.7,14.5 26.44,15.24 26.44,16.31 26.86,16.72 U2.1
SPI0_SCK  (via drill 0.3)
  Top 0.152: U2.6 29.36,16.85 29.64,16.56 v29.64,13.79 | U14.6 31.24,7.52 30.89,7.87 v30.89,9.35 | 32.97,11.43 31.47,12.93 v30.43,12.93 | 32.97,11.43 31.95,10.41 v30.89,10.41 | 32.97,11.43 U13.6
  Bottom 0.152: v30.89,9.35 v30.89,10.41 | v29.64,13.79 29.67,13.69 v30.43,12.93
SPI1_MISO
  Top 0.152: J5.2 11.51,21.38 13.28,19.62 U2.64
SPI1_MOSI
  Top 0.152: J5.3 8.73,22.37 11.03,22.37 13.28,20.12 U2.63
SPI1_PCS
  Top 0.152: J5.5 8.68,24.39 10.02,24.39 13.54,20.88 22.81,20.88 23.05,21.12 U2.61
SPI1_SCK
  Top 0.152: J5.4 10.53,23.38 13.39,20.52 22.96,20.52 23.06,20.62 U2.62
SPL_EN  (via drill 0.3)
  Top 0.152: U2.52 23.89,25.62 23.67,25.4 23.67,24.28 22.05,22.66 15.7,22.66 14.71,23.65 14.71,24.31 v14.99,24.59 | v14.76,28.7 14.76,29.54 16.58,31.36 U15.7
  Bottom 0.152: v14.99,24.59 14.91,24.71 14.91,28.55 v14.76,28.7
SPR_EN  (via drill 0.3)
  Top 0.152: U15.8 16.59,30.86 15.57,29.84 v15.57,28.7 | U2.51 23.83,26.12 23.32,25.6 23.32,24.43 21.89,23.01 16.18,23.01 v15.34,23.85
  Bottom 0.152: v15.34,23.85 15.57,24.08 15.57,24.84 15.27,25.15 15.27,28.4 v15.57,28.7
SWD_CLK  (via drill 0.3)
  Top 0.152: U2.22 v35.06,22.12 v35.05,22.12 | v32.89,21.87 30.58,19.56 27.48,19.56 25.78,17.86 6.02,17.83 4.72,17.83 2.45,20.1 J3.1
  Bottom 0.152: v32.89,21.87 33.35,22.33 34.85,22.33 v35.05,22.12
SWD_DIO  (via drill 0.3)
  Top 0.152: U2.25 35.38,23.62 35.05,23.29 v35.05,22.94 | v32.87,22.68 32.31,22.12 32.31,21.79 30.43,19.91 27.38,19.91 25.68,18.21 4.85,18.21 3.45,19.61 3.45,24.38 J3.5
  Bottom 0.152: v32.87,22.68 34.8,22.68 v35.05,22.94
TX2
  Top 0.152: U2.60 23.04,21.61 22.66,21.23 13.69,21.23 9.71,25.21 J5.6
U0_RX  (via drill 0.3)
  Top 0.152: U2.23 37.5,22.62 v37.59,22.71 | v32.05,22.63 31.93,22.45 31.93,21.92 30.28,20.27 27.28,20.27 25.58,18.57 5,18.57 4.45,19.12 J3.2
  Bottom 0.152: v32.05,22.63 32.05,22.71 32.61,23.27 33.12,23.27 33.35,23.04 34.31,23.04 34.8,23.52 35.31,23.52 35.66,23.16 37.11,23.16 37.57,22.71 v37.59,22.71
U0_TX  (via drill 0.3)
  Top 0.152: U2.24 37.19,23.12 v37.59,23.52 | v31.95,23.44 31.47,22.96 31.47,21.97 30.12,20.62 27.18,20.62 25.48,18.92 5.74,18.92 5.41,19.25 5.41,22.4 4.45,23.36 J3.4
  Bottom 0.152: v31.95,23.44 32.11,23.6 33.27,23.6 33.48,23.39 34.16,23.39 34.65,23.88 35.48,23.88 35.84,23.52 v37.59,23.52
U_RX  (via drill 0.3)
  Top 0.152: U2.17 38.31,19.62 40.54,21.84 48.87,21.84 v49.63,21.08 | U12.14 60.12,32.38 59.74,32.77 TP1.TP 58.6,32.77 58.34,32.51 R18.2 57.81,31.9 56.87,30.96 56.87,25.48 55.7,24.31 v52.86,24.31
  Bottom 0.152: v49.63,21.08 v52.86,24.31
U_RX__  (via drill 0.3)
  Top 0.152: C21.1 60.05,30.02 v60.4,29.67 | U12.1 60.53,25.53 60.38,25.38 R17.2 59.37,24.87 C18.2
  Top 0.203: U12.1 60.53,28.32 v60.45,28.4
  Bottom 0.152: v60.4,29.67 60.45,29.59 v60.45,28.4
U_TX+
  Top 0.152: U2.20 37.3,21.12 37.39,21.21 38.89,21.21 40.23,22.55 49.51,22.55 50.88,21.18 53.87,21.18 56.87,18.19 67.33,18.19 68.28,19.13 U10.1 68.28,21.19 68.4,21.31 68.41,22.69 68.73,23.01 69.16,23.01 69.77,23.62 69.77,24.41 68.94,25.25 U10.13
U_TX-
  Top 0.152: U2.19 37.31,20.62 37.52,20.83 39.01,20.83 40.39,22.2 49.35,22.2 50.72,20.83 53.72,20.83 56.72,17.83 70.55,17.83 70.88,18.16 U10.5 70.88,22.54 70.5,22.92 70.5,24.25 71.53,25.28 U10.9
URX_LEFT  (via drill 0.3)
  Top 0.152: v57.05,24.13 57.4,23.77 57.43,21.01 58.93,19.51 R19.1
  Bottom 0.152: J2.2 v57.05,24.13
UTX_LEFT+
  Top 0.152: U10.11 70.23,27.03 70,27.25 67.44,27.25 65.56,29.13 65.56,35.41 65.08,35.89 56.5,35.89 55.48,34.88 J2.8
UTX_LEFT-
  Top 0.152: U10.8 72.19,27.1 71.68,27.61 67.59,27.61 65.91,29.29 65.91,35.64 65.3,36.25 56.24,36.25 53.48,33.37 J2.7
UTX_RIGHT+  (via drill 0.3)
  Top 0.254: U10.3 69.58,18.94 v69.6,18.92 | v69.6,14.58 73.28,10.9 73.28,3.16 A1.TX+
  Bottom 0.254: v69.6,14.58 v69.6,18.92
UTX_RIGHT+1
  Bottom 0.203: J10.8 63.29,47.07 70.41,39.95 A2.RX-
UTX_RIGHT-  (via drill 0.3)
  Top 0.254: v71.5,18.06 71.53,18.08 U10.6 | A1.TX- 74.85,11 v70.99,14.86
  Bottom 0.254: v70.99,14.86 70.99,17.55 v71.5,18.06
V_GND  (via drill 0.3)
  Top 0.203: U12.5 63.13,27.8 v63.12,27.81 | U12.3 61.83,27.82 v61.85,27.84 | U12.12 61.83,29.76 v61.82,29.67 | R23.1 R25.2 C25.2 58.39,26.16 59.66,26.16 v59.77,26.26
  Bottom 0.203: v61.85,27.84 61.44,27.43 60.94,27.43 v59.77,26.26 | v61.85,27.84 63.09,27.84 v63.12,27.81 | v61.82,29.67 61.82,27.86 v61.85,27.84
VCC
  Top 0.203: U19.8 85.56,21.31 | 85.56,21.31 85.56,21.96 83.36,24.16 80.57,24.16 79.88,23.47 79.88,16.51 J9.1 82.27,16.36 88.44,16.36 | C49.2 85.56,21.31 | U18.8 92.31,16.91 C48.2 92.34,15.68 91.59,14.94 89.81,14.94 89.64,15.11 C50.2 89.05,15.75 88.44,16.36 | U20.4 88.46,16.37 88.44,16.36
VIN_BOOST  (via drill 0.3)
  Top 0.152: U4.3 44.47,12.44 45.09,13.06 45.09,14.22 45.24,14.38 45.77,14.38 U4.6 | v45.06,17.8 46.02,17.8 46.38,17.45 46.38,16.77 L1.1 | R10.2 36.96,17.48 v37.29,17.8 | v39.93,19.61 40.16,19.38 44.12,19.38 v44.35,19.61
  Top 0.254: U5.3 49.98,7.2 50.27,7.21
  Top 0.406: 46.38,16.74 L1.1 46.38,16.76 46.38,16.08 45.78,15.47 U4.6 47.02,14.39 C10.2 47.24,14.49 47.24,15.82 47.81,16.4 48.96,16.4 50.27,15.09 50.27,7.21 50.27,3.28 47.98,1.02 S1.4
  Bottom 0.152: v45.06,17.8 45.06,18.9 v44.35,19.61 | v37.29,17.8 38.84,19.36 39.67,19.36 v39.93,19.61
VIN_BUCK
  Top 0.203: U6.1 39.41,10.66 | U6.2 39.86,10.67 39.6,10.44
  Top 0.406: S1.1 38.67,1.18 40.69,3.2 arc90 41.81,4.32 arc90 40.74,5.44 40.74,9.55 40.34,9.96 39.95,9.96 39.7,10.21
  pour Top (isolate 0.203): 37.26,11.3 37.29,10.54 38.02,9.75 39.9,9.8 39.93,11.25
VIN_MCU  (via drill 0.3)
  Top 0.152: v53.01,21.79 51.97,21.79 50.65,23.11 50.65,27.61 46.38,31.88 35.84,31.88 35.36,32.36 v34.57,32.36 | v30.96,32.74 30.73,32.51 27.3,32.51 27.08,32.74 R7.2
  Top 0.254: v50.98,5.28 50.8,5.46 50.8,17.23 C3.2 50.82,17.7 50.93,17.8 v50.93,18.64 50.53,19.04 U1.3 | U7.5 45.36,8.46 45.77,8.05 v45.95,8.05 | U5.5 48.01,8.48 v47.57,8.05
  Bottom 0.152: v30.96,32.74 34.19,32.74 v34.57,32.36 | v50.93,18.64 51.94,19.66 52.68,19.66 53.01,19.99 v53.01,21.79
  Bottom 0.254: v47.57,8.05 v45.95,8.05
  Bottom 0.305: v47.57,8.05 47.57,7.95 48.62,6.91 48.62,5.08 | 48.62,5.08 50.77,5.08 v50.98,5.28 | S1.7 44.65,4.32 45.72,5.38 47.12,5.38 47.42,5.08 48.62,5.08

## Text on the board
tPlace: "Swiftlet" / Copyright (c) / 2015 by / K. C. Lee | "Swiftlet" Copyright / (c) 2015 by K. C. Lee | Right:TX / Left: RX | GND | SCK | SDA | VCC | Right:RX / Left: TX
bPlace: UTX- UTX+ | "Swiftlet" / Copyright (c) / 2015 by / K. C. Lee | SPL+ SPL- | MOT+ GND | GND URX | SCL +3V_MCU | SDA SWD_DIO | "Swiftlet" Copyright / (c) 2015 by K. C. Lee | TX0 GND | UTX+ UTX- | RX0 SWD_CLK | SPL- SPL+ | GND MOT+ | URX GND | +3V RX2 | TX2 PCS | SCK MOSI | MISO GND | AA OFF Li-Ion | USB Charger / Li-ion Only | Battery / Type